# EasyEDA Pro project ST-Link_v3_devkit.epro

# Schematic ST-Link_3.0_devkit
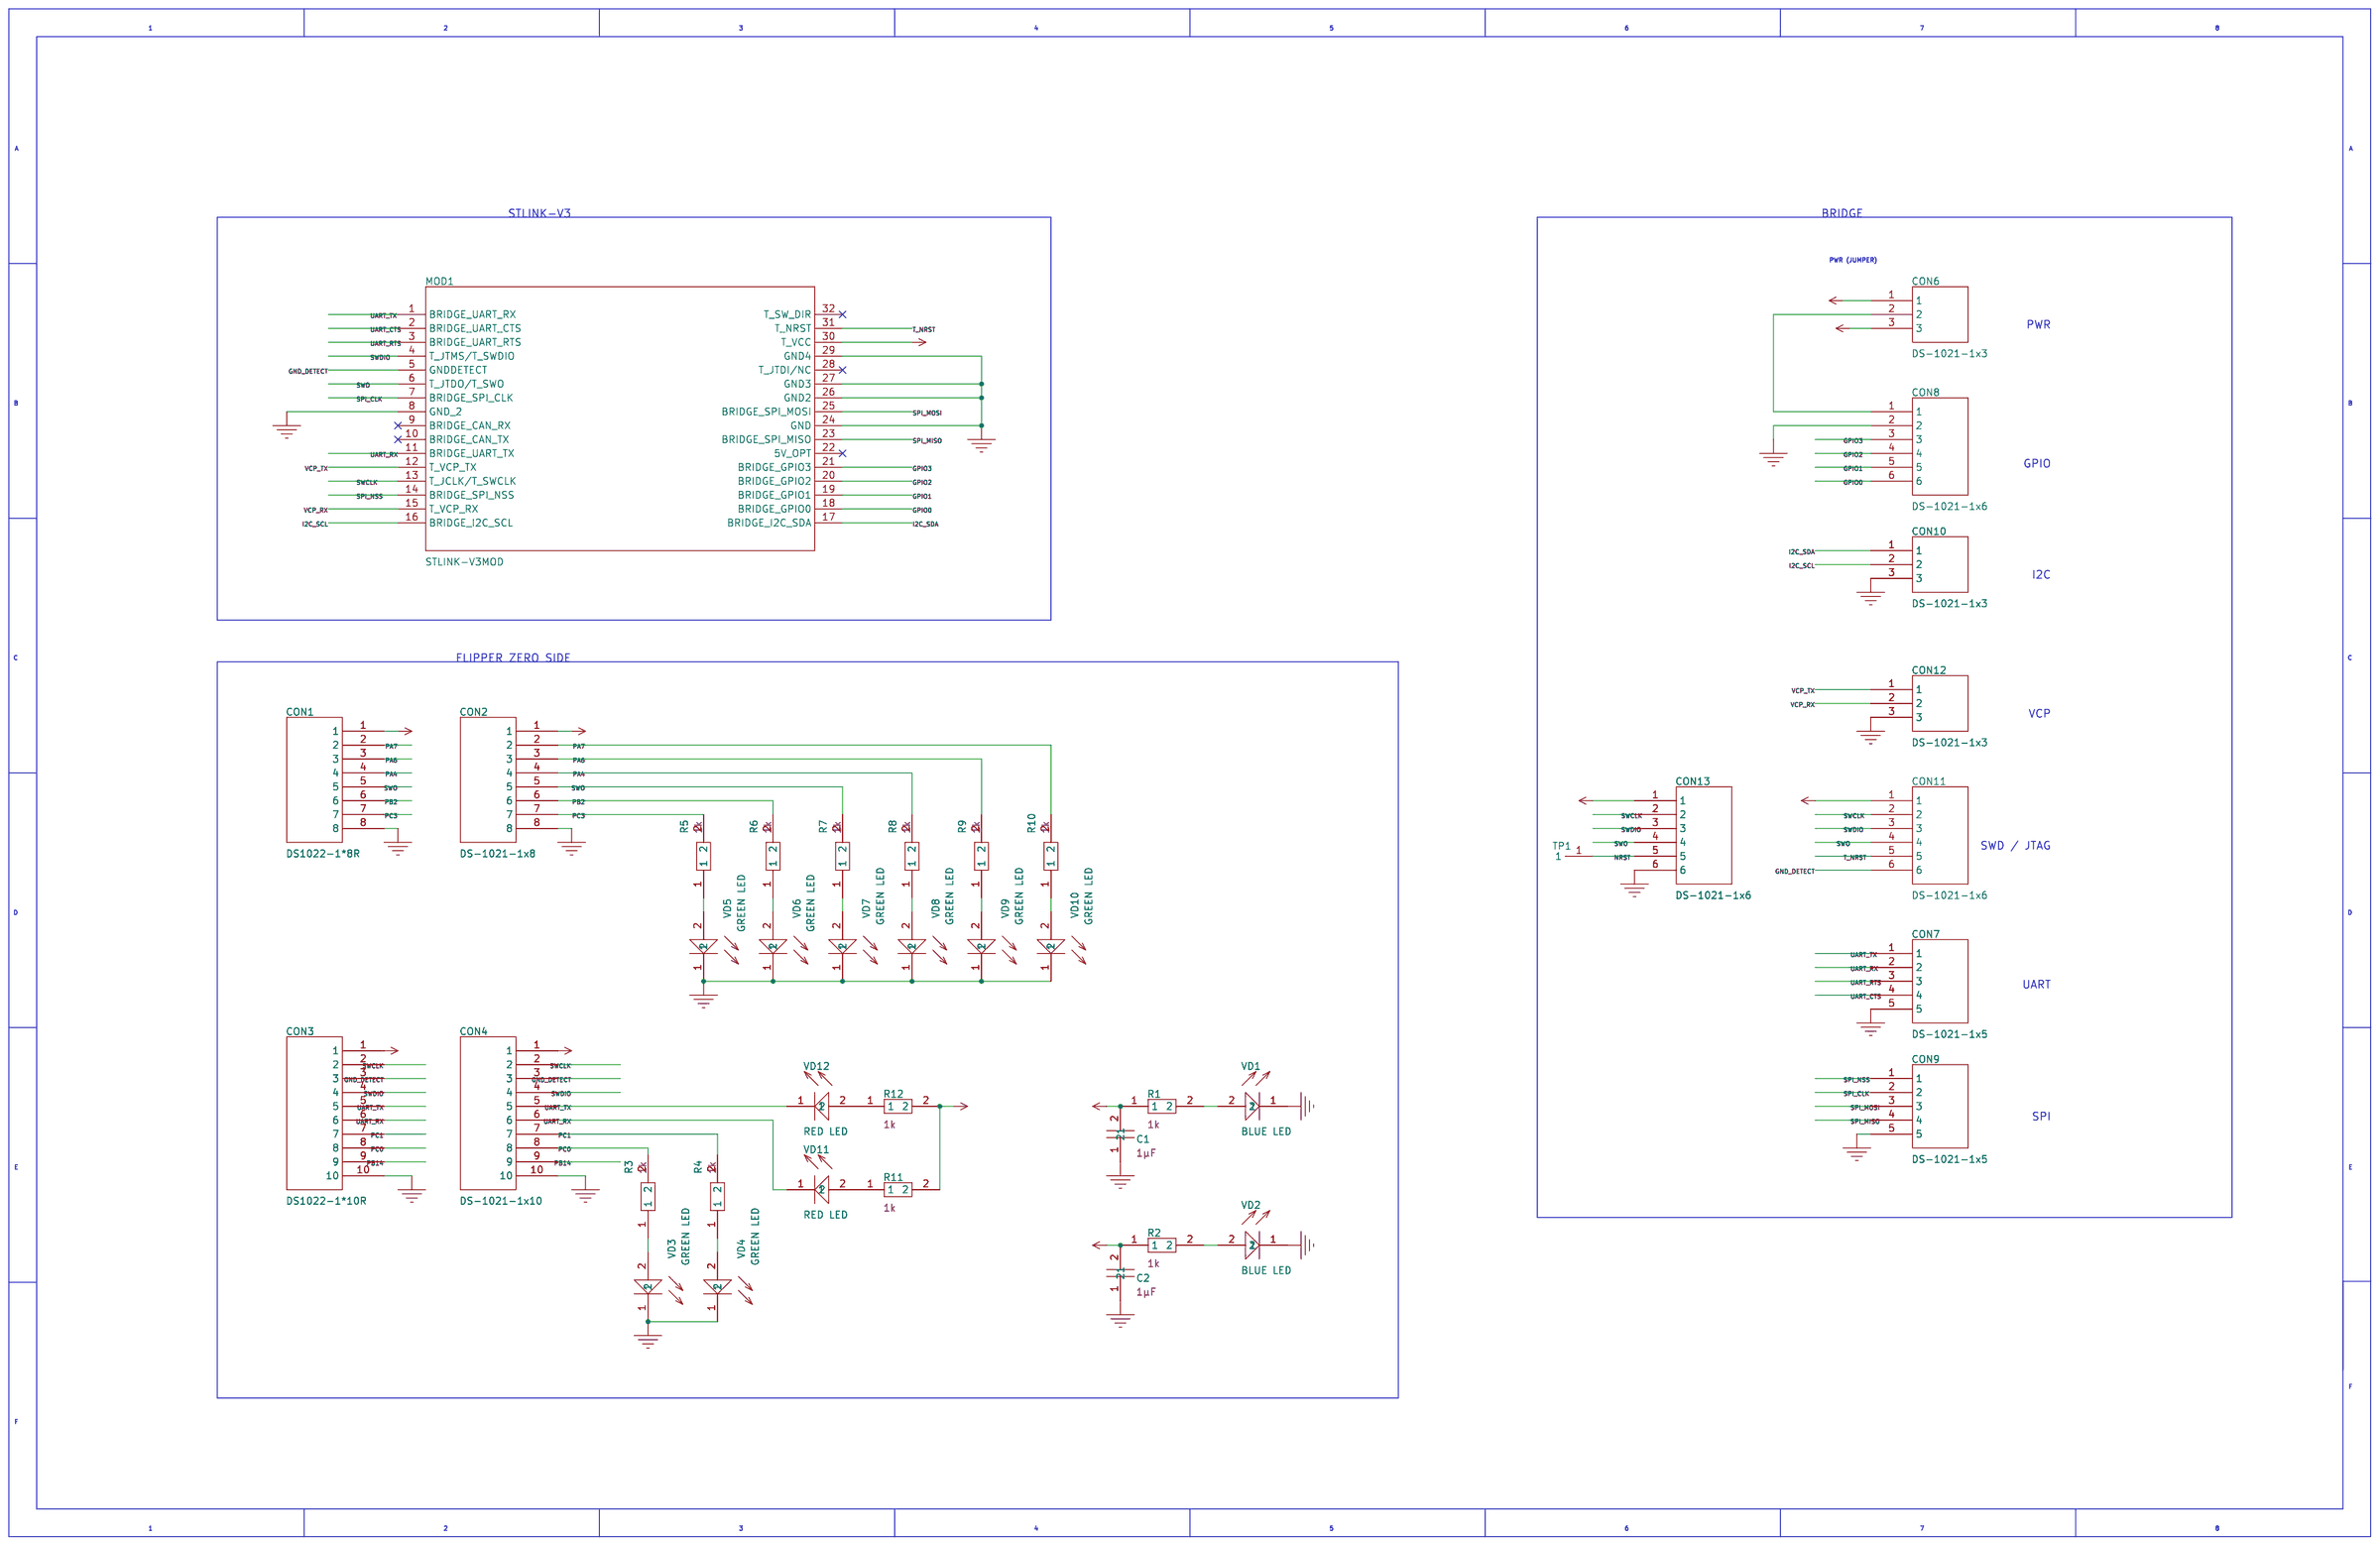
[diagram p0: schematic sheet]

## Parts
C1  1uF  [Capacitor_SMD:C_0603_1608Metric]
C2  1uF  [Capacitor_SMD:C_0603_1608Metric]
CON1  DS1022-1*8R  [Connector_PinHeader_2.54mm:PinHeader_1x08_P2.54mm_Horizontal]
CON2  DS-1021-1x8  [Connector_PinHeader_2.54mm:PinHeader_1x08_P2.54mm_Vertical]
CON3  DS1022-1*10R  [Connector_PinHeader_2.54mm:PinHeader_1x10_P2.54mm_Horizontal]
CON4  DS-1021-1x10  [Connector_PinHeader_2.54mm:PinHeader_1x10_P2.54mm_Vertical]
CON6  DS-1021-1x3  [Connector_PinHeader_2.54mm:PinHeader_1x03_P2.54mm_Vertical]
CON7  DS-1021-1x5  [Connector_PinHeader_2.54mm:PinHeader_1x05_P2.54mm_Vertical]
CON8  DS-1021-1x6  [Connector_PinHeader_2.54mm:PinHeader_1x06_P2.54mm_Vertical]
CON9  DS-1021-1x5  [Connector_PinHeader_2.54mm:PinHeader_1x05_P2.54mm_Vertical]
CON10  DS-1021-1x3  [Connector_PinHeader_2.54mm:PinHeader_1x03_P2.54mm_Vertical]
CON11  DS-1021-1x6  [Connector_PinHeader_2.54mm:PinHeader_1x06_P2.54mm_Vertical]
CON12  DS-1021-1x3  [Connector_PinHeader_2.54mm:PinHeader_1x03_P2.54mm_Vertical]
CON13  DS-1021-1x6  [Connector_PinHeader_2.54mm:PinHeader_1x06_P2.54mm_Vertical]
MOD1  STLINK-V3MOD  [Library:MODULE_STLINK-V3MODS]
R1  1K  [Resistor_SMD:R_0603_1608Metric]
R2  1K  [Resistor_SMD:R_0603_1608Metric]
R3  1K  [Resistor_SMD:R_0603_1608Metric]
R4  1K  [Resistor_SMD:R_0603_1608Metric]
R5  1K  [Resistor_SMD:R_0603_1608Metric]
R6  1K  [Resistor_SMD:R_0603_1608Metric]
R7  1K  [Resistor_SMD:R_0603_1608Metric]
R8  1K  [Resistor_SMD:R_0603_1608Metric]
R9  1K  [Resistor_SMD:R_0603_1608Metric]
R10  1K  [Resistor_SMD:R_0603_1608Metric]
R11  1K  [Resistor_SMD:R_0603_1608Metric]
R12  1K  [Resistor_SMD:R_0603_1608Metric]
TP1  Control_point  [TestPoint:TestPoint_Pad_D1.0mm]
VD1  BLUE LED
VD2  BLUE LED
VD3  GREEN LED
VD4  GREEN LED
VD5  GREEN LED  [LED_SMD:LED_0603_1608Metric]
VD6  GREEN LED  [LED_SMD:LED_0603_1608Metric]
VD7  GREEN LED  [LED_SMD:LED_0603_1608Metric]
VD8  GREEN LED  [LED_SMD:LED_0603_1608Metric]
VD9  GREEN LED  [LED_SMD:LED_0603_1608Metric]
VD10  GREEN LED  [LED_SMD:LED_0603_1608Metric]
VD11  RED LED
VD12  RED LED

## Library data of the parts
C1 C2 = ST-Link_3.0_devkit-altium-import_root_1_Symbol: Chip Capacitor; COMPONENT TYPE: Standard; CASE: 0603; PINS: 2; DESIGN ITEM ID: CAP_1uF_0603; TOLERANCE: 10%; SOURCE: Flipper_zero.SchLib; CASE/PACKAGE: 0603; INTERNAL_PN: FDCAP0016; ALTIUM_VALUE: 1µF; DIELECTRIC: X5R; VOLTAGE: 16V; COMPANY: Flipper Devices
CON1 = ST-Link_3.0_devkit-altium-import_root_0_DS-1022-1x8: Connector 2.54mm 1х8 Angular Type; SOURCE: MIDI.SchLib; COMPONENT TYPE: Standard; INTERNAL_PN: FDCON0014; DESIGN ITEM ID: DS-1022-1x8; COMPANY: Flipper Zero; PIN COUNT: 8
CON2 = ST-Link_3.0_devkit-altium-import_root_0_DS-1022-1x8: Connector 2.54mm 1х8 Straight Type; COMPANY: Flipper Zero; SOURCE: MIDI.SchLib; COMPONENT TYPE: Standard; PIN COUNT: 8; INTERNAL_PN: FDCON0016
CON3 = ST-Link_3.0_devkit-altium-import_root_0_DS-1022-1x10: Connector 2.54mm 1х10 Angular Type; INTERNAL_PN: FDCON0015; DESIGN ITEM ID: DS-1022-1x10; SOURCE: MIDI.SchLib; COMPANY: Flipper Zero; COMPONENT TYPE: Standard; PIN COUNT: 10
CON4 = ST-Link_3.0_devkit-altium-import_root_0_DS-1021-1x10: Connector 2.54mm 1х10 Straight Type; COMPONENT TYPE: Standard; INTERNAL_PN: FDCON0017; COMPANY: Flipper Zero; SOURCE: MIDI.SchLib; PIN COUNT: 10
CON6 CON10 CON12 = ST-Link_3.0_devkit-altium-import_root_0_mirrored_DS-1021-1x3: Connector 2.54mm 1х3 Straight Type; INTERNAL_PN: FDCON0018; COMPONENT TYPE: Standard; COMPANY: Flipper Zero; SOURCE: MIDI.SchLib; PIN COUNT: 3
CON7 CON9 = ST-Link_3.0_devkit-altium-import_root_0_mirrored_DS-1021-1x5: Connector 2.54mm 1х5 Straight Type; COMPANY: Flipper Zero; INTERNAL_PN: FDCON0020; PIN COUNT: 4; SOURCE: MIDI.SchLib; COMPONENT TYPE: Standard
CON8 CON11 CON13 = ST-Link_3.0_devkit-altium-import_root_0_mirrored_DS-1021-1x6: Connector 2.54mm 1х6 Straight Type; INTERNAL_PN: FDCON0021; SOURCE: MIDI.SchLib; COMPANY: Flipper Zero; PIN COUNT: 6; COMPONENT TYPE: Standard
MOD1 = ST-Link_3.0_devkit-altium-import_root_0_STLINK-V3MOD: STLINK-V3 Compact In-Circuit Debugger and Programmer for STM32 Microcontroller; COMPANY: Flipper Devices; INTERNAL_PN: FDMOD0002; PINS: 32
R1-R12 = ST-Link_3.0_devkit-altium-import_root_2_Symbol: Chip Resistor, 1 KOhm, +/-5%, 0.1 W, -55 to 155 degC, 0603 (1608 Metric); VOLTAGE RATING: 50V; INTERNAL_PN: FDRES0034; POWER: 100mW; ALTIUM_VALUE: 1k; CASE/PACKAGE: 0603; PINS: 2; ROHS COMPLIANT: True; COMPANY: Flipper Devices; TOLERANCE: 5%; MOUNTING TECHNOLOGY: SM
TP1 = ST-Link_3.0_devkit-altium-import_root_2_control point: Testpoint; PIN COUNT: 1; SOURCE: Flipper_zero.SchLib; COMPONENT TYPE: Standard (No BOM); DESIGN ITEM ID: control point; COMPANY: Flipper Devices; CLASSNAME: Testpoint
VD1 VD2 = ST-Link_3.0_devkit-altium-import_root_0_VSMY14940: LED; COMPANY: Flipper Devices; SOURCE: Flipper_zero.SchLib; INTERNAL_PN: FDDIO0008; PIN COUNT: 2; CASE/PACKAGE: 0603; CASE: SMD/SMT; COMPONENT TYPE: Standard
VD3-VD10 = ST-Link_3.0_devkit-altium-import_root_3_VSMY14940: LED; COMPANY: Flipper Devices; SOURCE: Flipper_zero.SchLib; INTERNAL_PN: FDDIO0009; PIN COUNT: 2; CASE/PACKAGE: 0603; CASE: SMD/SMT; COMPONENT TYPE: Standard
VD11 VD12 = ST-Link_3.0_devkit-altium-import_root_0_mirrored_VSMY14940: LED; COMPANY: Flipper Devices; SOURCE: Flipper_zero.SchLib; INTERNAL_PN: FDDIO0010; PIN COUNT: 2; CASE/PACKAGE: 0603; CASE: SMD/SMT; COMPONENT TYPE: Standard

## Nets
GND_DETECT: CON3.3 CON4.3 CON11.6 MOD1.5(GNDDETECT)
GPIO0: CON8.6 MOD1.18(BRIDGE_GPIO0)
GPIO1: CON8.5 MOD1.19(BRIDGE_GPIO1)
GPIO2: CON8.4 MOD1.20(BRIDGE_GPIO2)
GPIO3: CON8.3 MOD1.21(BRIDGE_GPIO3)
I2C_SCL: CON10.2 MOD1.16(BRIDGE_I2C_SCL)
I2C_SDA: CON10.1 MOD1.17(BRIDGE_I2C_SDA)
NRST: CON13.5 TP1.1
PA4: CON1.4 CON2.4 R8.2
PA6: CON1.3 CON2.3 R9.2
PA7: CON1.2 CON2.2 R10.2
PB2: CON1.6 CON2.6 R6.2
PB14: CON3.9 CON4.9
PC0: CON3.8 CON4.8 R3.2
PC1: CON3.7 CON4.7 R4.2
PC3: CON1.7 CON2.7 R5.2
SPI_CLK: CON9.2 MOD1.7(BRIDGE_SPI_CLK)
SPI_MISO: CON9.4 MOD1.23(BRIDGE_SPI_MISO)
SPI_MOSI: CON9.3 MOD1.25(BRIDGE_SPI_MOSI)
SPI_NSS: CON9.1 MOD1.14(BRIDGE_SPI_NSS)
ST-LINK_3.0_DEVKIT-ALTIUM-IMPORT_3V3_GOST_ARROW: C2.2 CON3.1 CON4.1 CON6.3 CON11.1 CON13.1 MOD1.30(T_VCC) R2.1 R11.2 R12.2
ST-LINK_3.0_DEVKIT-ALTIUM-IMPORT_5V_GOST_ARROW: C1.2 CON1.1 CON2.1 CON6.1 R1.1
ST-LINK_3.0_DEVKIT-ALTIUM-IMPORT_GND_POWER_GROUND: C1.1 C2.1 CON1.8 CON2.8 CON3.10 CON4.10 CON7.5 CON8.2 CON9.5 CON10.3 CON12.3 CON13.6 MOD1.8(GND_2) MOD1.24(GND) MOD1.26(GND2) MOD1.27(GND3) MOD1.29(GND4) VD1.1 VD2.1 VD3.1 VD4.1 VD5.1 VD6.1 VD7.1 VD8.1 VD9.1 VD10.1
SWCLK: CON3.2 CON4.2 CON11.2 CON13.2 MOD1.13(T_JCLK/T_SWCLK)
SWDIO: CON3.4 CON4.4 CON11.3 CON13.3 MOD1.4(T_JTMS/T_SWDIO)
SWO: CON1.5 CON2.5 CON11.4 CON13.4 MOD1.6(T_JTDO/T_SWO) R7.2
T_NRST: CON11.5 MOD1.31(T_NRST)
UART_CTS: CON7.4 MOD1.2(BRIDGE_UART_CTS)
UART_RTS: CON7.3 MOD1.3(BRIDGE_UART_RTS)
UART_RX: CON3.6 CON4.6 CON7.2 MOD1.11(BRIDGE_UART_TX) VD11.1
UART_TX: CON3.5 CON4.5 CON7.1 MOD1.1(BRIDGE_UART_RX) VD12.1
VCP_RX: CON12.2 MOD1.15(T_VCP_RX)
VCP_TX: CON12.1 MOD1.12(T_VCP_TX)
NET-(CON6-PAD2): CON6.2 CON8.1
Net-(R1-2): R1.2 VD1.2
Net-(R2-2): R2.2 VD2.2
Net-(R3-1): R3.1 VD3.2
Net-(R4-1): R4.1 VD4.2
NET-(R5-PAD1): R5.1 VD5.2
NET-(R6-PAD1): R6.1 VD6.2
NET-(R7-PAD1): R7.1 VD7.2
NET-(R8-PAD1): R8.1 VD8.2
NET-(R9-PAD1): R9.1 VD9.2
NET-(R10-PAD1): R10.1 VD10.2
Net-(R11-1): R11.1 VD11.2
Net-(R12-1): R12.1 VD12.2

Not connected (* = marked no-connect by the designer): MOD1 9(BRIDGE_CAN_RX)* 10(BRIDGE_CAN_TX)* 22(5V_OPT)* 28(T_JTDI/NC)* 32(T_SW_DIR)*

## Notes on the sheet
- 1
- 2
- 3
- 4
- 5
- 6
- 7
- 8
- A
- A
- STLINK-V3
- BRIDGE
- PWR (JUMPER)
- PWR
- B
- B
- GPIO
- I2C
- C
- FLIPPER ZERO SIDE
- C
- VCP
- SWD / JTAG
- D
- D
- UART
- SPI
- E
- E
- F
- F
- 1
- 2
- 3
- 4
- 5
- 6
- 7
- 8

# Board ST-Link_3.0_devkit
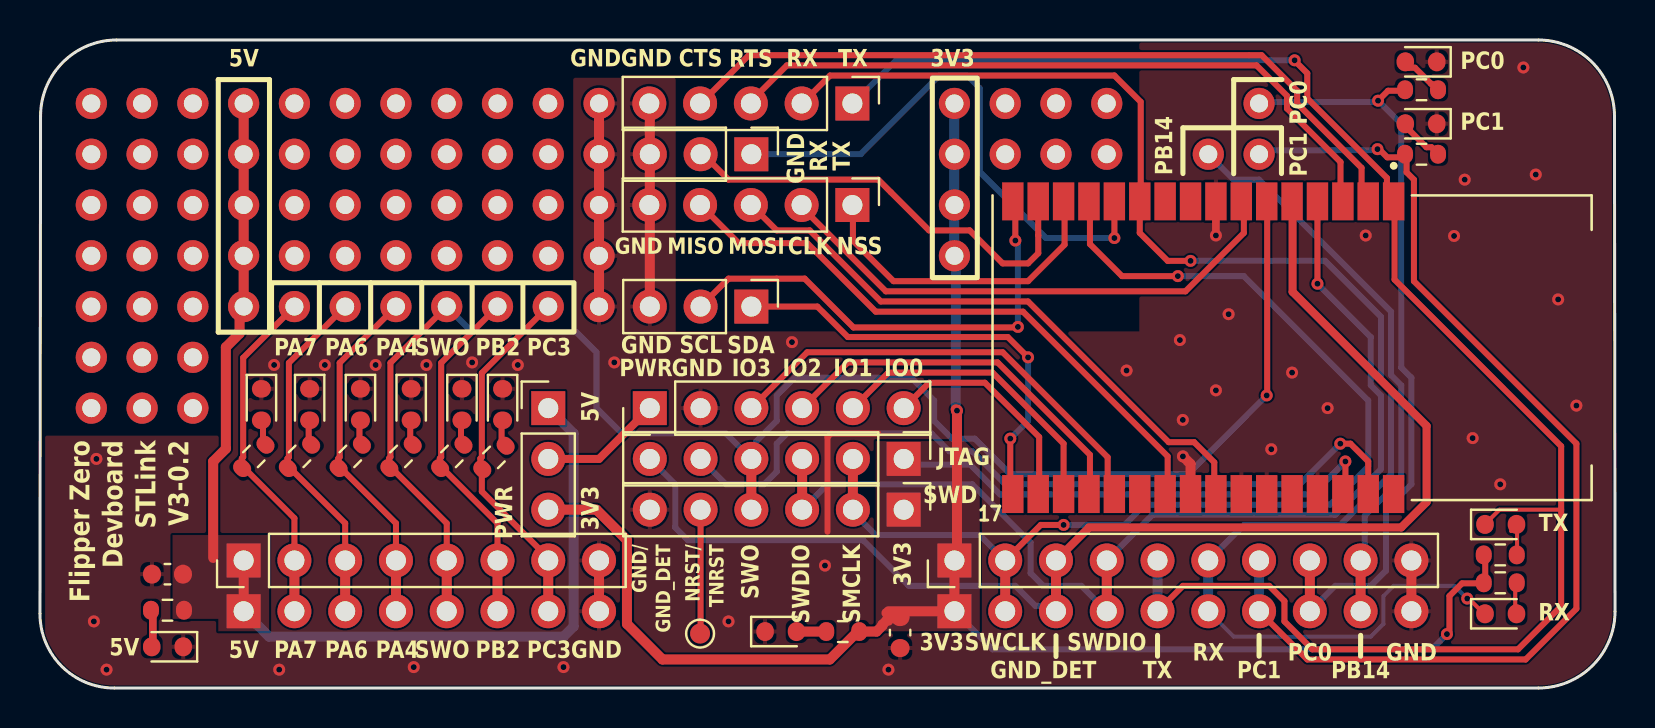
[diagram p1: board, top side]
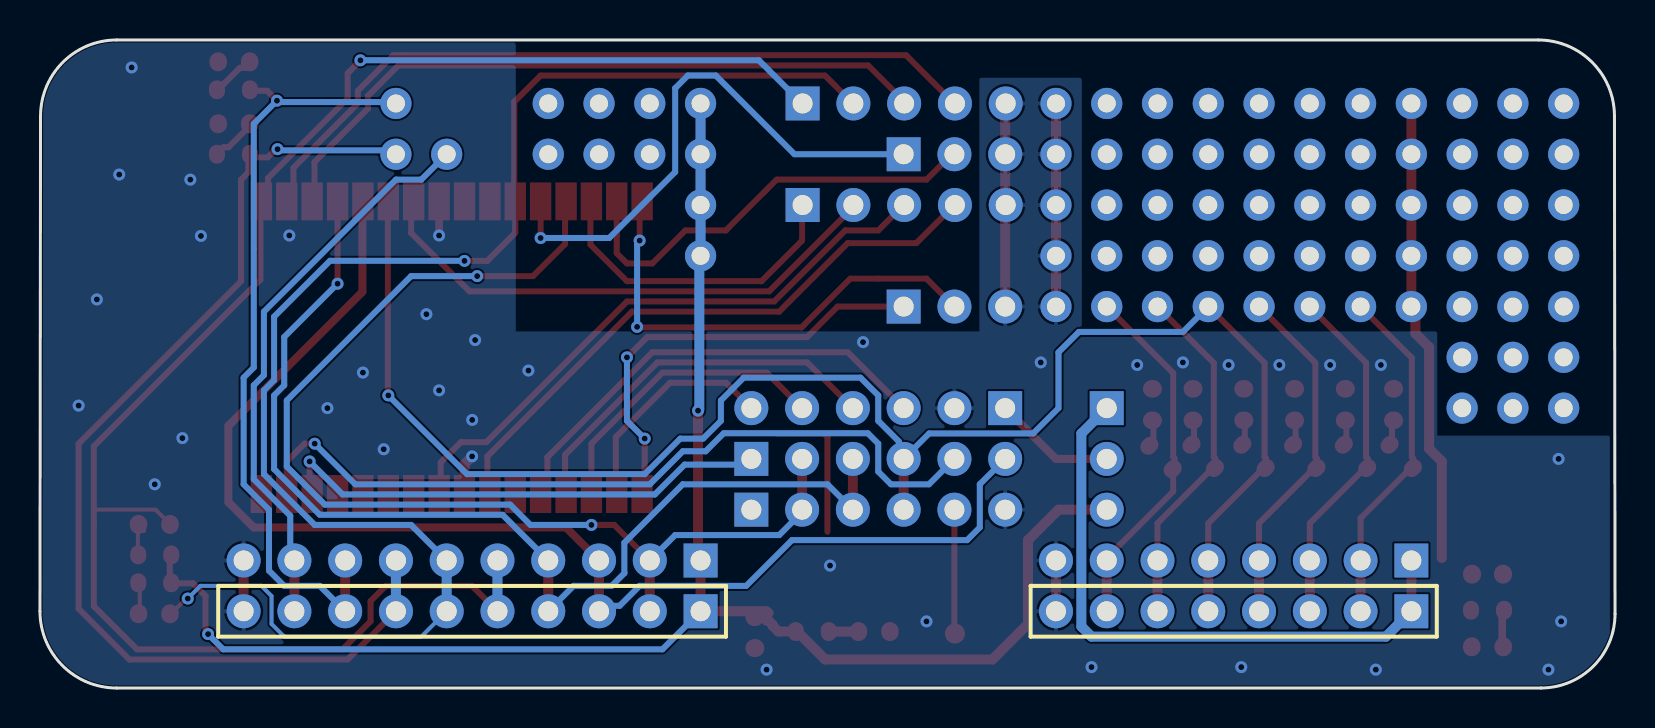
[diagram p2: board, bottom side, seen from below]

Outline 78.8 x 32.41 mm; copper layers: Top Layer, Bottom Layer. Coordinates in mm from the lower left corner of the outline.
Outline path: 0,3.71 0.03,28.6 arc(1.14,31.3) 3.84,32.41 74.96,32.41 arc(77.65,31.3) 78.77,28.6 78.8,3.84 arc(77.67,1.12) 74.96,0 3.71,0 arc(1.09,1.09) 0,3.71
Stack: Top Layer 0.035mm / Dielectric1 1.51mm FR4 er 4.5 / Bottom Layer 0.035mm

## Design rules (mm)
spacing safeClearance (default): track to track 0, other pairs 0 to 0.5
track width trackWidth (default): min 0.127, default 0.254, max 2.54
differential pair differentialPair (default): width min 0.127, default 0.254, max 2.54; gap min 0.152, default 0.152
via viaSize (default): diameter min 0.5, default 0.61, max 10; hole min 0.3, default 0.305, max 6
net GND uses CopperRegion1
pour ie2000 uses CopperRegion
pour ie2001 uses CopperRegion1

## Placement (name value [footprint] x y rotation side)
3V3  BLUE LED  [LED_SMD:LED_0603_1608Metric]  37.06 2.82 0 top
5V  BLUE LED  [LED_SMD:LED_0603_1608Metric]  6.38 2.06 180 top
C1  1uF  [Capacitor_SMD:C_0603_1608Metric]  6.38 5.69 0 top
C2  1uF  [Capacitor_SMD:C_0603_1608Metric]  43.03 2.77 90 top
CON1  DS1022-1*8R  [Connector_PinHeader_2.54mm:PinHeader_1x08_P2.54mm_Horizontal]  10.19 3.84 270 bottom
CON2  DS-1021-1x8  [Connector_PinHeader_2.54mm:PinHeader_1x08_P2.54mm_Vertical]  10.19 6.38 90 top
CON3  DS1022-1*10R  [Connector_PinHeader_2.54mm:PinHeader_1x10_P2.54mm_Horizontal]  45.75 3.84 270 bottom
CON4  DS-1021-1x10  [Connector_PinHeader_2.54mm:PinHeader_1x10_P2.54mm_Vertical]  45.75 6.38 90 top
CON6  DS-1021-1x3  [Connector_PinHeader_2.54mm:PinHeader_1x03_P2.54mm_Vertical]  25.43 14 0 top
CON7  DS-1021-1x5  [Connector_PinHeader_2.54mm:PinHeader_1x05_P2.54mm_Vertical]  40.64 29.24 270 top
CON8  DS-1021-1x6  [Connector_PinHeader_2.54mm:PinHeader_1x06_P2.54mm_Vertical]  30.51 14 90 top
CON9  DS-1021-1x5  [Connector_PinHeader_2.54mm:PinHeader_1x05_P2.54mm_Vertical]  40.64 24.16 270 top
CON10  DS-1021-1x3  [Connector_PinHeader_2.54mm:PinHeader_1x03_P2.54mm_Vertical]  35.59 19.08 270 top
CON11  DS-1021-1x6  [Connector_PinHeader_2.54mm:PinHeader_1x06_P2.54mm_Vertical]  43.21 11.46 270 top
CON12  DS-1021-1x3  [Connector_PinHeader_2.54mm:PinHeader_1x03_P2.54mm_Vertical]  35.59 26.7 270 top
CON13  DS-1021-1x6  [Connector_PinHeader_2.54mm:PinHeader_1x06_P2.54mm_Vertical]  43.21 8.92 270 top
MOD1  STLINK-V3MOD  [Library:MODULE_STLINK-V3MODS]  77.63 17.02 270 top
NOREF  -  [footprint_4e81]  22.89 19.08 0 top
NOREF#2  -  [footprint_4e81]  25.43 19.08 0 top
NOREF#3  -  [footprint_4e81]  15.27 19.08 0 top
NOREF#4  -  [footprint_4e81]  27.97 19.08 0 top
NOREF#5  -  [footprint_4e81]  10.19 19.08 0 top
NOREF#6  -  [footprint_4e81]  20.35 19.08 0 top
NOREF#7  -  [footprint_4e81]  17.81 19.08 0 top
NOREF#8  -  [footprint_4a84]  45.75 26.7 0 top
NOREF#9  -  [footprint_4a84]  60.99 29.24 0 top
NOREF#10  -  [footprint_4a84]  45.75 29.24 0 top
NOREF#11  -  [footprint_4a84]  7.65 29.24 0 top
NOREF#12  -  [footprint_4a84]  15.27 21.62 0 top
NOREF#13  -  [footprint_4a84]  10.19 24.16 0 top
NOREF#14  -  [footprint_4a84]  7.65 21.62 0 top
NOREF#15  -  [footprint_4a84]  45.75 21.62 0 top
NOREF#16  -  [footprint_4a84]  2.57 29.24 0 top
NOREF#17  -  [footprint_4a84]  27.97 21.62 0 top
NOREF#18  -  [footprint_4a84]  5.11 14 0 top
NOREF#19  -  [footprint_4a84]  22.89 21.62 0 top
NOREF#20  -  [footprint_4a84]  17.81 29.24 0 top
NOREF#21  -  [footprint_4a84]  12.73 24.16 0 top
NOREF#22  -  [footprint_4a84]  22.89 26.7 0 top
NOREF#23  -  [footprint_4a84]  12.73 19.08 0 top
NOREF#24  -  [footprint_4a84]  53.37 29.24 0 top
NOREF#25  -  [footprint_4a84]  5.11 29.24 0 top
NOREF#26  -  [footprint_4a84]  5.11 21.62 0 top
NOREF#27  -  [footprint_4a84]  27.97 26.7 0 top
NOREF#28  -  [footprint_4a84]  2.57 26.7 0 top
NOREF#29  -  [footprint_4a84]  15.27 26.7 0 top
NOREF#30  -  [footprint_4a84]  27.97 24.16 0 top
NOREF#31  -  [footprint_4a84]  5.11 26.7 0 top
NOREF#32  -  [footprint_4a84]  7.65 19.08 0 top
NOREF#33  -  [footprint_4a84]  5.11 19.08 0 top
NOREF#34  -  [footprint_4a84]  50.83 29.24 0 top
NOREF#35  -  [footprint_4a84]  7.65 26.7 0 top
NOREF#36  -  [footprint_4a84]  22.89 29.24 0 top
NOREF#37  -  [footprint_4a84]  20.35 24.16 0 top
NOREF#38  -  [footprint_4a84]  58.45 26.7 0 top
NOREF#39  -  [footprint_4a84]  5.11 16.54 0 top
NOREF#40  -  [footprint_4a84]  25.43 24.16 0 top
NOREF#41  -  [footprint_4a84]  2.57 24.16 0 top
NOREF#42  -  [footprint_4a84]  10.19 29.24 0 top
NOREF#43  -  [footprint_4a84]  45.75 24.16 0 top
NOREF#44  -  [footprint_4a84]  17.81 24.16 0 top
NOREF#45  -  [footprint_4a84]  25.43 26.7 0 top
NOREF#46  -  [footprint_4a84]  25.43 21.62 0 top
NOREF#47  -  [footprint_4a84]  2.57 21.62 0 top
NOREF#48  -  [footprint_4a84]  2.57 16.54 0 top
NOREF#49  -  [footprint_4a84]  7.65 24.16 0 top
NOREF#50  -  [footprint_4a84]  25.43 29.24 0 top
NOREF#51  -  [footprint_4a84]  20.35 26.7 0 top
NOREF#52  -  [footprint_4a84]  7.65 16.54 0 top
NOREF#53  -  [footprint_4a84]  10.19 21.62 0 top
NOREF#54  -  [footprint_4a84]  7.65 14 0 top
NOREF#55  -  [footprint_4a84]  48.29 26.7 0 top
NOREF#56  -  [footprint_4a84]  20.35 29.24 0 top
NOREF#57  -  [footprint_4a84]  12.73 21.62 0 top
NOREF#58  -  [footprint_4a84]  2.57 19.08 0 top
NOREF#59  -  [footprint_4a84]  15.27 29.24 0 top
NOREF#60  -  [footprint_4a84]  17.81 21.62 0 top
NOREF#61  -  [footprint_4a84]  20.35 21.62 0 top
NOREF#62  -  [footprint_4a84]  27.97 29.24 0 top
NOREF#63  -  [footprint_4a84]  2.57 14 0 top
NOREF#64  -  [footprint_4a84]  60.99 26.7 0 top
NOREF#65  -  [footprint_4a84]  15.27 24.16 0 top
NOREF#66  -  [footprint_4a84]  48.29 29.24 0 top
NOREF#67  -  [footprint_4a84]  17.81 26.7 0 top
NOREF#68  -  [footprint_4a84]  12.73 26.7 0 top
NOREF#69  -  [footprint_4a84]  5.11 24.16 0 top
NOREF#70  -  [footprint_4a84]  53.37 26.7 0 top
NOREF#71  -  [footprint_4a84]  50.83 26.7 0 top
NOREF#72  -  [footprint_4a84]  10.19 26.7 0 top
NOREF#73  -  [footprint_4a84]  22.89 24.16 0 top
NOREF#74  -  [footprint_4a84]  12.73 29.24 0 top
PC0  GREEN LED  [LED_SMD:LED_0603_1608Metric]  69.09 31.32 180 top
PC1  GREEN LED  [LED_SMD:LED_0603_1608Metric]  69.09 28.22 180 top
R1  1K  [Resistor_SMD:R_0603_1608Metric]  6.38 3.89 180 top
R2  1K  [Resistor_SMD:R_0603_1608Metric]  40.16 2.82 180 top
R3  1K  [Resistor_SMD:R_0603_1608Metric]  69.12 29.93 180 top
R4  1K  [Resistor_SMD:R_0603_1608Metric]  69.12 26.7 180 top
R5  1K  [Resistor_SMD:R_0603_1608Metric]  22.71 11.54 225 top
R6  1K  [Resistor_SMD:R_0603_1608Metric]  20.6 11.59 225 top
R7  1K  [Resistor_SMD:R_0603_1608Metric]  18.06 11.59 225 top
R8  1K  [Resistor_SMD:R_0603_1608Metric]  15.52 11.59 225 top
R9  1K  [Resistor_SMD:R_0603_1608Metric]  12.98 11.59 225 top
R10  1K  [Resistor_SMD:R_0603_1608Metric]  10.7 11.59 225 top
R11  1K  [Resistor_SMD:R_0603_1608Metric]  73.05 5.26 180 top
R12  1K  [Resistor_SMD:R_0603_1608Metric]  73.05 6.66 180 top
RX  RED LED  [LED_SMD:LED_0603_1608Metric]  73.08 3.71 0 top
TP1  Control_point  [TestPoint:TestPoint_Pad_D1.0mm]  33.02 2.72 0 top
TX  RED LED  [LED_SMD:LED_0603_1608Metric]  73.08 8.18 0 top
VD5  GREEN LED  [LED_SMD:LED_0603_1608Metric]  23.14 14.18 270 top
VD6  GREEN LED  [LED_SMD:LED_0603_1608Metric]  21.11 14.18 270 top
VD7  GREEN LED  [LED_SMD:LED_0603_1608Metric]  18.57 14.18 270 top
VD8  GREEN LED  [LED_SMD:LED_0603_1608Metric]  16.03 14.18 270 top
VD9  GREEN LED  [LED_SMD:LED_0603_1608Metric]  13.49 14.18 270 top
VD10  GREEN LED  [LED_SMD:LED_0603_1608Metric]  11.08 14.18 270 top

## Footprints (pads in the part's own frame, mm; a bottom-side part is the same pattern mirrored in y, then rotated)
Capacitor_SMD:C_0603_1608Metric
  rrect 0.9x0.95 smd: 1(-0.775,0) 2(0.775,0)
Connector_PinHeader_2.54mm:PinHeader_1x03_P2.54mm_Vertical
  rect 1.7x1.7 hole 1: 1(0,0)
  round 1.7 hole 1: 2(0,-2.54) 3(0,-5.08)
Connector_PinHeader_2.54mm:PinHeader_1x05_P2.54mm_Vertical
  rect 1.7x1.7 hole 1: 1(0,0)
  round 1.7 hole 1: 2(0,-2.54) 3(0,-5.08) 4(0,-7.62) 5(0,-10.16)
Connector_PinHeader_2.54mm:PinHeader_1x06_P2.54mm_Vertical
  rect 1.7x1.7 hole 1: 1(0,0)
  round 1.7 hole 1: 2(0,-2.54) 3(0,-5.08) 4(0,-7.62) 5(0,-10.16) 6(0,-12.7)
Connector_PinHeader_2.54mm:PinHeader_1x08_P2.54mm_Horizontal
  rect 1.7x1.7 hole 1: 1(0,0)
  round 1.7 hole 1: 2(0,-2.54) 3(0,-5.08) 4(0,-7.62) 5(0,-10.16) 6(0,-12.7) 7(0,-15.24) 8(0,-17.78)
Connector_PinHeader_2.54mm:PinHeader_1x08_P2.54mm_Vertical
  rect 1.7x1.7 hole 1: 1(0,0)
  round 1.7 hole 1: 2(0,-2.54) 3(0,-5.08) 4(0,-7.62) 5(0,-10.16) 6(0,-12.7) 7(0,-15.24) 8(0,-17.78)
Connector_PinHeader_2.54mm:PinHeader_1x10_P2.54mm_Horizontal
  rect 1.7x1.7 hole 1: 1(0,0)
  round 1.7 hole 1: 2(0,-2.54) 3(0,-5.08) 4(0,-7.62) 5(0,-10.16) 6(0,-12.7) 7(0,-15.24) 8(0,-17.78) 9(0,-20.32) 10(0,-22.86)
Connector_PinHeader_2.54mm:PinHeader_1x10_P2.54mm_Vertical
  rect 1.7x1.7 hole 1: 1(0,0)
  round 1.7 hole 1: 2(0,-2.54) 3(0,-5.08) 4(0,-7.62) 5(0,-10.16) 6(0,-12.7) 7(0,-15.24) 8(0,-17.78) 9(0,-20.32) 10(0,-22.86)
footprint_4a84
  round 1.56 hole 0.9: (0,0)
footprint_4e81
  round 1.56 hole 0.9: 2(0,0)
LED_SMD:LED_0603_1608Metric
  rrect 0.875x0.95 smd: 1(-0.787,0) 2(0.787,0)
Library:MODULE_STLINK-V3MODS
  rect 1.9x1.07 smd: 1(-7.32,-9.906) 2(-7.32,-11.176) 3(-7.32,-12.446) 4(-7.32,-13.716) 5(-7.32,-14.986) 6(-7.32,-16.256) 7(-7.32,-17.526) 8(-7.32,-18.796) 9(-7.32,-20.066) 10(-7.32,-21.336) 11(-7.32,-22.606) 12(-7.32,-23.876) 13(-7.32,-25.146) 14(-7.32,-26.416) 15(-7.32,-27.686) 16(-7.32,-28.956) 17(7.32,-28.956) 18(7.32,-27.686) 19(7.32,-26.416) 20(7.32,-25.146) 21(7.32,-23.876) 22(7.32,-22.606) 23(7.32,-21.336) 24(7.32,-20.066) 25(7.32,-18.796) 26(7.32,-17.526) 27(7.32,-16.256) 28(7.32,-14.986) 29(7.32,-13.716) 30(7.32,-12.446) 31(7.32,-11.176) 32(7.32,-9.906)
Resistor_SMD:R_0603_1608Metric
  rrect 0.8x0.95 smd: 1(-0.825,0) 2(0.825,0)
TestPoint:TestPoint_Pad_D1.0mm
  round 1 smd: 1(0,0)

## Nets
3V3: C2.2 CON3.1 CON4.1 CON6.3 CON11.1 CON13.1 MOD1.30 NOREF#8. NOREF#10. NOREF#15. NOREF#43. R2.1 R11.2 R12.2
5V: C1.2 CON1.1 CON2.1 CON6.1 NOREF#5.2 NOREF#13. NOREF#42. NOREF#53. NOREF#72. R1.1
/GND_DETECT: CON3.3 CON4.3 CON11.6 MOD1.5
GND: 3V3.1 5V.1 C1.1 C2.1 CON1.8 CON2.8 CON3.10 CON4.10 CON7.5 CON8.2 CON9.5 CON10.3 CON12.3 CON13.6 MOD1.8 MOD1.24 MOD1.26 MOD1.27 MOD1.29 NOREF#4.2 NOREF#17. NOREF#27. NOREF#30. NOREF#62. PC0.1 PC1.1 VD5.1 VD6.1 VD7.1 VD8.1 VD9.1 VD10.1
/GPIO0: CON8.6 MOD1.18
/GPIO1: CON8.5 MOD1.19
/GPIO2: CON8.4 MOD1.20
/GPIO3: CON8.3 MOD1.21
/I2C_SCL: CON10.2 MOD1.16
/I2C_SDA: CON10.1 MOD1.17
/NRST: CON13.5 TP1.1
/PA4: CON1.4 CON2.4 NOREF#7.2 R8.2
/PA6: CON1.3 CON2.3 NOREF#3.2 R9.2
/PA7: CON1.2 CON2.2 NOREF#23. R10.2
/PB2: CON1.6 CON2.6 NOREF.2 R6.2
/PB14: CON3.9 CON4.9 NOREF#38.
/PC0: CON3.8 CON4.8 NOREF#9. R3.2
/PC1: CON3.7 CON4.7 NOREF#64. R4.2
/PC3: CON1.7 CON2.7 NOREF#2.2 R5.2
/SPI_CLK: CON9.2 MOD1.7
/SPI_MISO: CON9.4 MOD1.23
/SPI_MOSI: CON9.3 MOD1.25
/SPI_NSS: CON9.1 MOD1.14
/SWCLK: CON3.2 CON4.2 CON11.2 CON13.2 MOD1.13
/SWDIO: CON3.4 CON4.4 CON11.3 CON13.3 MOD1.4
/SWO: CON1.5 CON2.5 CON11.4 CON13.4 MOD1.6 NOREF#6.2 R7.2
/T_NRST: CON11.5 MOD1.31
/UART_CTS: CON7.4 MOD1.2
/UART_RTS: CON7.3 MOD1.3
/UART_RX: CON3.6 CON4.6 CON7.2 MOD1.11 RX.1
/UART_TX: CON3.5 CON4.5 CON7.1 MOD1.1 TX.1
/VCP_RX: CON12.2 MOD1.15
/VCP_TX: CON12.1 MOD1.12
NET-(CON6-PAD2): CON6.2 CON8.1
NET-(R1-PAD2): 5V.2 R1.2
NET-(R2-PAD2): 3V3.2 R2.2
NET-(R3-PAD1): PC0.2 R3.1
NET-(R4-PAD1): PC1.2 R4.1
NET-(R5-PAD1): R5.1 VD5.2
NET-(R6-PAD1): R6.1 VD6.2
NET-(R7-PAD1): R7.1 VD7.2
NET-(R8-PAD1): R8.1 VD8.2
NET-(R9-PAD1): R9.1 VD9.2
NET-(R10-PAD1): R10.1 VD10.2
NET-(R11-PAD1): R11.1 RX.2
NET-(R12-PAD1): R12.1 TX.2
UNCONNECTED-(MOD1-5V_OPT-PAD22): MOD1.22
UNCONNECTED-(MOD1-BRIDGE_CAN_RX-PAD9): MOD1.9
UNCONNECTED-(MOD1-BRIDGE_CAN_TX-PAD10): MOD1.10
UNCONNECTED-(MOD1-T_JTDI{SLASH}NC-PAD28): MOD1.28
UNCONNECTED-(MOD1-T_SW_DIR-PAD32): MOD1.32

## Via types
v1: diameter 0.6, hole 0.3, Top Layer to Bottom Layer, 54 vias

## Routing (per net, layer and track width the routed paths; a pad name or vN(x,y) marks a point on that pad's centre or on a via; arc(x,y) is an arc through that point)
3V3: length 108.8
  Top Layer w0.3: 70.51,2.85 70.51,4.6 71.15,5.24 72.3,5.24 72.3,6.63 ; v1(65.31,11.33) 65.31,9.43 65.23,9.35
  Top Layer w0.5: 42.45,3.84 CON3.1 CON4.1 45.88,6.51 v1(45.88,13.87) 45.81,13.94 ; v1(70.39,2.7) 70.39,2.72 ; 40.91,2.82 41.85,2.82 42.15,3.12 42.15,3.17 42.35,3.37 42.45,3.37 ; 40.91,2.82 39.51,1.43 31.14,1.43 29.37,3.2 29.37,7.4 27.84,8.92 CON6.3 ; 40.91,2.82 40.92,2.84 ; 42.35,3.75 42.45,3.75
  Bottom Layer w0.3: CON3.1 47.65,1.93 69.62,1.93 v1(70.39,2.7) ; CON11.1 43.49,11.17 46.54,11.17 48.03,9.68 63.66,9.68 v1(65.31,11.33)
  Bottom Layer w0.5: 45.75,21.62 45.75,29.24 ; 45.81,13.94 45.81,21.62
5V: length 54.6
  Top Layer w0.5: 10.19,29.24 NOREF#5.2 9.99,18.88 9.99,17.73 9.3,17.05 9.3,11.97 8.66,11.33 8.66,6.51 ; CON1.1 CON2.1
  Bottom Layer w0.5: CON6.1 26.7,12.73 26.7,3.08 26.19,2.57 11.46,2.57 CON1.1
/GND_DETECT: length 64.8
  Top Layer w0.4: CON4.3 52.48,8.03 68.1,8.03 69.37,9.3 69.37,13.11 62.67,19.82 62.67,24.3 62.64,24.32
  Top Layer w0.5: CON3.3 CON4.3
  Bottom Layer w0.3: CON11.6 31.78,10.19 31.78,8.03 32.41,7.4 41.18,7.4 43.46,5.11 48.8,5.11 49.79,4.11 50.55,4.11 CON3.3
GND: length 36.5
  Top Layer w0.3: 41.94,12.73 39.57,12.73 39.4,12.55 39.4,7.82
  Top Layer w0.381: v1(58.83,22.64) 58.83,24.32
  Top Layer w0.5: 30.51,29.24 CON12.3 CON10.3 ; 57.56,9.68 57.56,11.21 v1(57.18,11.59) ; 27.97,29.24 NOREF#4.2 ; CON3.10 CON4.10 ; CON1.8 CON2.8
  vias: v1(2.7,3.33) v1(2.82,11.46) v1(3.33,0.92) v1(11.71,16.16) v1(11.97,0.92) v1(14.25,16.16) v1(16.79,16.16) v1(18.7,1.05) v1(19.33,16.16) v1(21.62,16.29) v1(23.9,16.16) v1(26.19,1.05) v1(28.73,16.29) v1(34.45,3.33) v1(37.62,17.3) v1(39.27,6.13) v1(42.45,0.92) v1(54.36,15.88) v1(57.03,17.41) v1(57.17,13.41) v1(58.83,14.89) v1(59.46,18.7) v1(61.6,11.94) v1(62.64,15.78) v1(64.42,14) v1(66.32,22.64) v1(70.74,22.61) v1(71.28,25.43) v1(71.67,12.5) v1(73.05,10.19) v1(74.21,31.04) v1(74.83,25.68) v1(75.95,19.44) v1(76.86,14.13)
/GPIO0: length 11.6
  Top Layer w0.3: 49.99,9.35 49.99,12.55 47.27,15.27 44.48,15.27 CON8.6
/GPIO1: length 15.6
  Top Layer w0.3: CON8.5 42.45,15.78 47.65,15.78 51.21,12.22 51.21,9.39
/GPIO2: length 19.6
  Top Layer w0.3: 52.53,9.35 52.53,11.67 47.91,16.29 40.41,16.29 CON8.4
/GPIO3: length 23.5
  Top Layer w0.3: CON8.3 38.38,16.79 48.16,16.79 53.41,11.54 53.41,9.73 53.8,9.35
/I2C_SCL: length 23.8
  Top Layer w0.3: CON10.2 34.45,20.48 38.26,20.48 40.7,18.03 48.89,18.03 v1(48.92,18.06) ; 48.67,24.32 48.8,24.19 v1(48.8,22.38)
  Bottom Layer w0.3: v1(48.92,18.06) 48.92,22.17 48.8,22.3 v1(48.8,22.38)
/I2C_SDA: length 22.5
  Top Layer w0.3: 48.67,9.39 48.54,9.52 v1(48.54,12.48) ; CON10.1 38.89,19.08 40.41,17.56 48.42,17.56 v1(49.43,16.54)
  Bottom Layer w0.3: v1(49.43,16.54) 49.43,13.36 v1(48.54,12.48)
/NRST: length 6.3
  Top Layer w0.3: 33.05,2.65 CON13.5
/PA4: length 17.6
  Top Layer w0.3: CON2.4 17.81,8.24 14.92,11.13 14.92,11.48 14.99,11.55 14.99,16.26 NOREF#7.2
  Top Layer w0.5: CON1.4 CON2.4
/PA6: length 17.6
  Top Layer w0.3: NOREF#3.2 12.45,16.26 12.45,11.55 12.38,11.48 12.38,11.13 15.27,8.24 CON2.3
  Top Layer w0.5: CON1.3 CON2.3
/PA7: length 17.4
  Top Layer w0.3: CON2.2 12.73,8.49 10.1,11.13 10.1,11.48 10.17,11.55 10.17,16.52 12.73,19.08
  Top Layer w0.5: CON1.2 CON2.2
/PB2: length 17.6
  Top Layer w0.3: CON2.6 22.89,8.24 20,11.13 20,11.48 20.07,11.55 20.07,16.26 NOREF.2
  Top Layer w0.5: CON1.6 CON2.6
/PB14: length 28.4
  Top Layer w0.5: CON3.9 CON4.9
  Bottom Layer w0.3: 58.45,26.7 59.72,25.43 60.99,25.43 67.59,18.83 67.59,15.65 68.1,15.14 68.1,10.44 66.28,8.62 66.28,6.59 CON4.9
/PC0: length 39.6
  Top Layer w0.3: 68.24,29.65 68.24,29.75 68.12,29.88 67.44,29.88 v1(66.94,29.38)
  Top Layer w0.5: CON3.8 CON4.8
  Bottom Layer w0.3: CON4.8 63.78,6.38 ; CON3.8 64.8,5.11 66.58,5.11 67.34,5.87 67.34,8.92 68.61,10.19 68.61,15.52 68.1,16.03 68.1,28.22 v1(66.94,29.38) ; 61.06,29.31 66.87,29.31
/PC1: length 54.4
  Top Layer w0.3: CON3.7 63.4,1.43 74.32,1.43 76.86,3.97 76.86,12.22 68.74,20.35 68.74,25.43 68.37,25.8 68.37,26.55 67.4,26.55 66.99,26.95 v1(66.91,26.95) ; CON4.7 60.99,6.51
  Bottom Layer w0.3: 61.07,26.7 61.26,26.9 66.85,26.9 v1(66.91,26.95) ; CON4.7 60.99,6.51
  Bottom Layer w0.5: CON3.7 CON4.7
/PC3: length 18.1
  Top Layer w0.3: NOREF#2.2 22.1,15.76 22.1,11.55 22.03,11.48 22.03,11.13 22.1,11.06 22.1,9.83 25.43,6.51 CON2.7
  Top Layer w0.5: CON1.7 CON2.7
/SPI_CLK: length 26.4
  Top Layer w0.3: 60.15,23.99 60.23,23.91 60.23,22.76 57.31,19.84 42.32,19.84 38.13,24.03 38.13,24.16
/SPI_MISO: length 30.8
  Top Layer w0.3: 56.34,9.35 56.42,9.43 56.42,11.59 49.18,18.83 41.81,18.83 38.38,22.25 34.95,22.25 33.05,24.16
/SPI_MOSI: length 30.5
  Top Layer w0.3: 58.88,9.35 58.75,9.48 58.75,11.29 57.74,12.3 56.47,12.3 49.43,19.33 42.07,19.33 38.51,22.89 36.86,22.89 35.59,24.16
/SPI_NSS: length 15.8
  Top Layer w0.3: 51.26,23.99 51.26,22.18 49.43,20.35 42.7,20.35 40.67,22.38 40.67,24.16
/SWCLK: length 56.2
  Top Layer w0.3: 52.53,23.99 52.53,22.21 54.13,20.6 v1(56.92,20.6) ; v1(51.21,8.16) 50.07,8.16 CON4.2
  Top Layer w0.5: CON13.2 CON11.2 ; CON3.2 CON4.2
  Bottom Layer w0.3: CON4.2 47.02,7.65 41.81,7.65 40.67,8.79 CON13.2 ; v1(56.92,20.6) 60.23,20.6 66.45,14.38 66.45,11.08 64.54,9.17 55.27,9.17 54.26,8.16 v1(51.21,8.16)
/SWDIO: length 54.1
  Top Layer w0.3: v1(63.91,20.22) 63.91,23.78
  Top Layer w0.5: CON3.4 CON4.4 ; CON13.3 CON11.3
  Bottom Layer w0.3: CON3.4 52.1,5.11 50.19,5.11 49.56,5.74 49.56,7.27 46.64,10.19 39.4,10.19 CON13.3 ; v1(63.91,20.22) 66.58,17.56 66.58,15.14 67.08,14.63 67.08,10.95 64.8,8.67 55.65,8.67 CON4.4
/SWO: length 82.3
  Top Layer w0.3: CON2.5 20.35,8.24 17.46,11.13 17.46,11.48 17.53,11.55 17.53,16.26 NOREF#6.2 ; v1(61.37,14.63) 61.39,14.66 61.39,23.91 61.37,23.94
  Top Layer w0.5: CON1.5 CON2.5 ; CON13.4 CON11.4
  Bottom Layer w0.3: v1(61.37,14.63) 57.43,10.7 48.54,10.7 46.76,12.48 45.62,12.48 44.73,13.36 44.73,14.38 43.59,15.52 37.75,15.52 36.86,14.63 36.86,13.36 35.83,12.34 35.83,11.7 CON11.4 34.31,12.73 29.11,12.73 27.84,14 27.84,16.79 26.83,17.81 21.62,17.81 NOREF#6.2
/T_NRST: length 40
  Top Layer w0.3: 66.45,9.39 66.45,11.33 65.56,12.22 v1(65.05,12.22)
  Bottom Layer w0.3: v1(65.05,12.22) 63.02,10.19 48.29,10.19 46.64,11.84 45.49,11.84 44.59,12.74 37.38,12.74 36.86,12.22 36.86,10.82 36.22,10.19 34.32,10.19 CON11.5
/UART_CTS: length 39
  Top Layer w0.3: 66.5,23.99 66.12,24.37 66.12,26.02 62.89,29.24 62.89,29.88 61.12,31.65 35.46,31.65 33.05,29.24
/UART_RTS: length 35.1
  Top Layer w0.3: 35.59,29.24 35.59,29.37 37.37,31.14 60.86,31.14 62.39,29.62 62.39,28.99 65.06,26.31 65.06,24.15 65.23,23.99
/UART_RX: length 76.8
  Top Layer w0.2: 72.25,3.71 71.48,4.47 v1(71.4,4.47)
  Top Layer w0.3: 55.07,24.32 55.07,29.32 53.75,30.64 39.53,30.64 38.13,29.24 ; 55.02,24.32 55.02,22.76 56.42,21.37 v1(57.56,21.37)
  Bottom Layer w0.2: v1(71.4,4.47) 70.77,5.11 67.72,5.11 67.21,4.6 67.21,3.2 66.58,2.57 59.72,2.57 CON3.6
  Bottom Layer w0.3: CON4.6 60.23,8.16 65.05,8.16 67.59,10.7 67.59,14.89 67.08,15.4 67.08,18.57 64.29,21.37 57.56,21.37 v1(57.56,21.37)
  Bottom Layer w0.5: CON3.6 CON4.6
/UART_TX: length 85.7
  Top Layer w0.2: 76.1,8.92 73.01,8.92 72.25,8.15
  Top Layer w0.3: 67.77,23.99 67.77,20.43 76.1,12.09 76.1,4.09 73.94,1.93 63.66,1.93 62.26,3.33 62.26,4.35 61.5,5.11 57.18,5.11 CON3.5 ; 67.72,24.32 67.39,24.66 67.39,25.51 63.4,29.49 63.4,30.75 62.77,31.38 v1(62.77,31.4)
  Bottom Layer w0.3: v1(62.77,31.4) 42.83,31.4 40.67,29.24
  Bottom Layer w0.5: CON3.5 CON4.5
/VCP_RX: length 21.9
  Top Layer w0.3: 49.94,24.32 49.94,22.64 49.94,22.63 49.94,21.75 49.43,21.24 48.16,21.24 46.51,22.89 44.48,22.89 41.94,25.43 34.45,25.43 33.18,26.7 CON12.2
/VCP_TX: length 27.4
  Top Layer w0.3: v1(53.75,22.51) 53.75,24.32
  Bottom Layer w0.3: v1(53.75,22.51) 50.32,22.51 47.02,25.81 47.02,30 46.38,30.64 44.99,30.64 41.05,26.7 CON12.1
NET-(CON6-PAD2): length 6.1
  Top Layer w0.4: CON6.2 27.97,11.46 CON8.1
NET-(R1-PAD2): length 1.8
  Top Layer w0.381: 5.65,2.05 5.65,3.84
NET-(R2-PAD2): length 2.8
  Top Layer w0.2: 3V3.2 R2.2
  Top Layer w0.5: 38.08,2.82 39.41,2.82
NET-(R3-PAD1): length 2.1
  Top Layer w0.3: 69.87,29.88 69.87,29.97 69.62,30.22 69.59,30.22 68.79,31.03 68.48,31.03 68.36,31.15
NET-(R4-PAD1): length 2.5
  Top Layer w0.3: 69.87,26.55 69.87,26.8 69.62,27.05 69.36,27.05 68.52,27.89 68.52,27.98 68.27,28.23
NET-(R5-PAD1): length 1.3
  Top Layer w0.3: 23.14,13.41 23.09,13.37 23.09,12.19 23.17,12.12
NET-(R6-PAD1): length 1.3
  Top Layer w0.3: 21.11,13.41 21.06,13.37 21.06,12.19 21.13,12.12
NET-(R7-PAD1): length 1.3
  Top Layer w0.3: 18.57,13.41 18.52,13.37 18.52,12.19 18.59,12.12
NET-(R8-PAD1): length 1.3
  Top Layer w0.3: 16.03,13.41 15.98,13.37 15.98,12.19 16.05,12.12
NET-(R9-PAD1): length 1.3
  Top Layer w0.3: 13.49,13.41 13.44,13.37 13.44,12.19 13.51,12.12
NET-(R10-PAD1): length 1.4
  Top Layer w0.3: 11.07,13.41 11.16,13.33 11.16,12.19 11.23,12.12
NET-(R11-PAD1): length 1.6
  Top Layer w0.2: 73.8,5.24 73.8,3.8 73.9,3.71
NET-(R12-PAD1): length 2
  Top Layer w0.2: 73.8,6.63 73.9,6.73 73.9,8.15 73.6,7.85

## Copper pours and planes (outline as drawn; the poured copper is in the pictures)
GND on Top Layer: 0.28,0.03 79.28,0.03 79.28,32.41 55.02,32.41 55.02,17.81 31.78,17.81 31.78,30.5 26.7,30.5 26.7,17.81 8.92,17.81 8.92,12.6 0.28,12.6
GND on Bottom Layer: 0.28,0.03 79.28,0.03 79.28,32.41 55.02,32.41 55.02,17.81 31.78,17.81 31.78,30.5 26.7,30.5 26.7,17.81 8.92,17.81 8.92,12.6 0.28,12.6
(no net) on Top Layer: 6.63,7.65 11.46,7.65 11.46,2.84 6.63,2.84
(no net) on Top Layer: 41.81,12.35 47.02,12.35 47.02,2.84 41.81,2.84

## Text on the board
Bottom Solder Mask Layer: @Shilapi
Top Silkscreen Layer: 17 | GND/ / GND_DET | NRST/ / TNRST | MISO | MOSI | GND | RX | 5V | CTS | SCL | RTS | SDA | IO3 | IO2 | CLK | TX | IO1 | NSS | IO0 | 3V3 | SWCLK | GND_DET | SWDIO | PC1 | PC0 | PB14 | PA4 | SWO | PB2 | PC3 | PWR | SWD | JTAG | SMCLK | PA7 | PA6 | Flipper Zero | Devboard | STLink | V3-0.2
